# Altium schematic sheet Motor PSU Webench.schdoc
size 317 x 144 mm; SheetNumber: 1; SheetTotal: 1
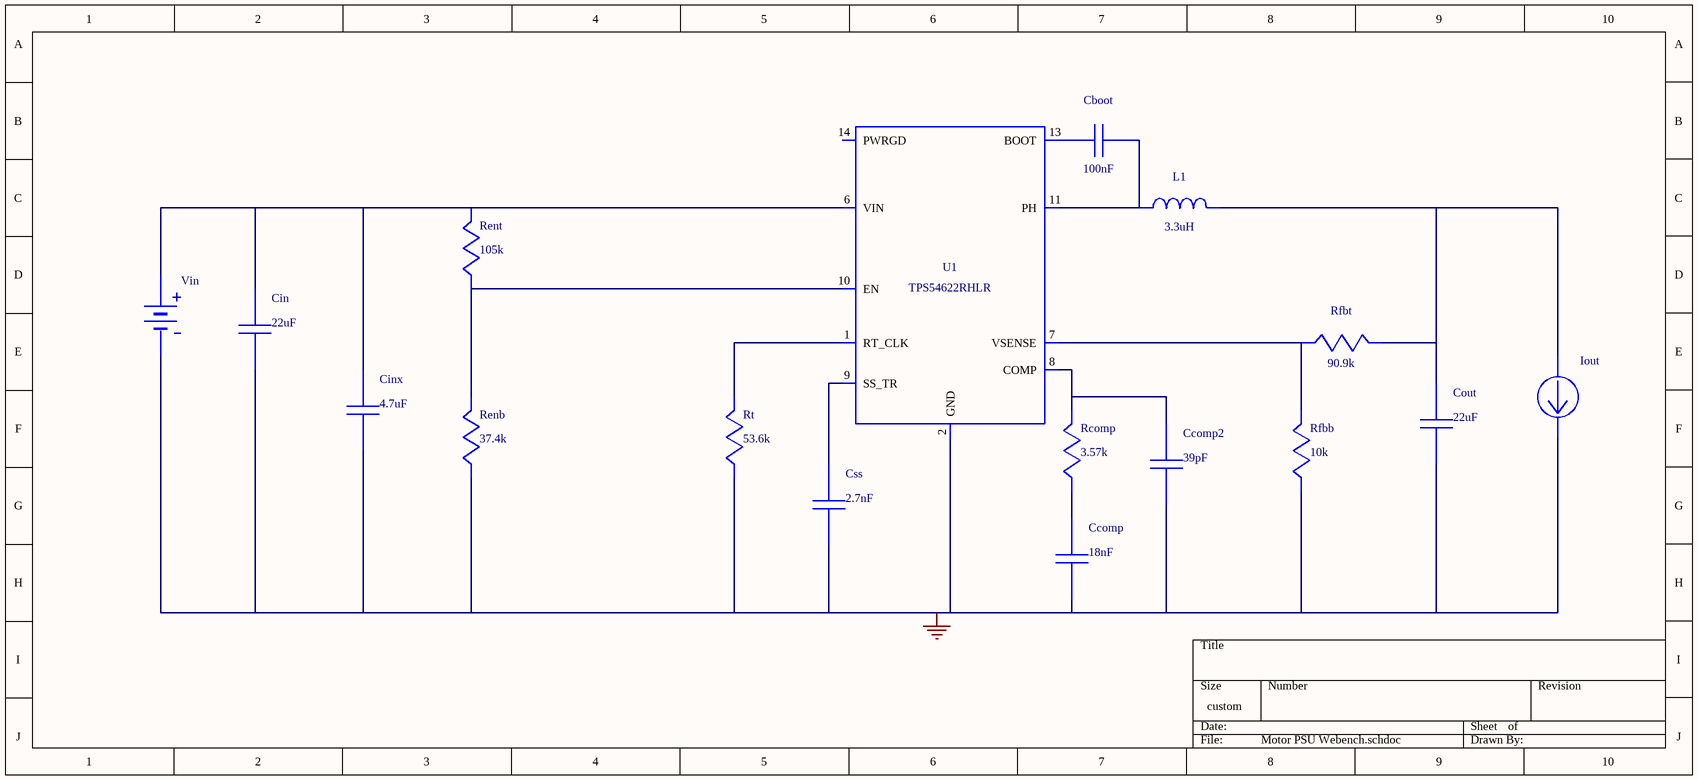
[diagram p0: Motor PSU Webench.schdoc]

## Parts
Cboot  value 100nF  (hidden comment: 08053C104KAT2A)
Ccomp  value 18nF  (hidden comment: CC0805KRX7R9BB183)
Ccomp2  value 39pF  (hidden comment: CC0805JRNPO9BN390)
Cin  value 22uF  (hidden comment: GRM31CR61C226ME15L)
Cinx  value 4.7uF  (hidden comment: GRM21BR61E475KA12L)
Cout  value 22uF  (hidden comment: GRM31CR61A226KE19L)
Css  value 2.7nF  (hidden comment: CC0805KRX7R9BB272)
Iout  WB_CURRENT_LOAD  (value not drawn)
L1  value 3.3uH  (hidden comment: SRP6540-3R3M)
Rcomp  value 3.57k  (hidden comment: CRCW04023K57FKED)
Renb  value 37.4k  (hidden comment: CRCW040237K4FKED)
Rent  value 105k  (hidden comment: CRCW0402105KFKED)
Rfbb  value 10k  (hidden comment: CRCW040210K0FKED)
Rfbt  value 90.9k  (hidden comment: CRCW040290K9FKED)
Rt  value 53.6k  (hidden comment: CRCW040253K6FKED)
U1  TPS54622RHLR
Vin  WB_BATTERY  (value not drawn)

## Nets
0: Ccomp.2 Ccomp2.2 Cin.2 Cinx.2 Cout.2 Css.2 Iout.2(-) Renb.2 Rfbb.2 Rt.2 U1.2(GND) U1.3(GND) U1.15(ETPAD) Vin.2(-)
NetCboot_1: Cboot.1 U1.13(BOOT)
NetCboot_2: Cboot.2 L1.1 U1.11(PH) U1.12(PH)
NetCcomp2_1: Ccomp2.1 Rcomp.1 U1.8(COMP)
NetCcomp_1: Ccomp.1 Rcomp.2
NetCin_1: Cin.1 Cinx.1 Rent.1 U1.4(PVIN) U1.5(PVIN) U1.6(VIN) Vin.1(+)
NetCout_1: Cout.1 Iout.1(+) L1.2 Rfbt.1
NetCss_1: Css.1 U1.9(SS_TR)
NetRenb_1: Renb.1 Rent.2 U1.10(EN)
NetRfbb_1: Rfbb.1 Rfbt.2 U1.7(VSENSE)
NetRt_1: Rt.1 U1.1(RT_CLK)

Not connected (* = marked no-connect by the designer): U1 14(PWRGD)

## Library data of the parts
Cboot = 08053C104KAT2A: Manufacturer Name: AVX; PackageReference: 08053C104KAT2A; Manufacturer Part Number: 08053C104KAT2A
Ccomp = CC0805KRX7R9BB183: CC0805KRX7R9BB18; Manufacturer Name: Yageo America; PackageReference: CC0805KRX7R9BB183; Manufacturer Part Number: CC0805KRX7R9BB183
Ccomp2 = CC0805JRNPO9BN390: CC0805JRNPO9BN39; Manufacturer Name: Yageo America; PackageReference: CC0805JRNPO9BN390; Manufacturer Part Number: CC0805JRNPO9BN390
Cin = GRM31CR61C226ME15L: GRM31CR61C226ME1; Manufacturer Name: MuRata; PackageReference: GRM31CR61C226ME15L; Manufacturer Part Number: GRM31CR61C226ME15L
Cinx = GRM21BR61E475KA12L: GRM21BR61E475KA1; Manufacturer Name: MuRata; PackageReference: GRM21BR61E475KA12L; Manufacturer Part Number: GRM21BR61E475KA12L
Cout = GRM31CR61A226KE19L: GRM31CR61A226KE1; Manufacturer Name: MuRata; PackageReference: GRM31CR61A226KE19L; Manufacturer Part Number: GRM31CR61A226KE19L
Css = CC0805KRX7R9BB272: CC0805KRX7R9BB27; Manufacturer Name: Yageo America; PackageReference: CC0805KRX7R9BB272; Manufacturer Part Number: CC0805KRX7R9BB272
Iout = WB_CURRENT_LOAD: Value: UNLISTED; PackageReference: WB_CURRENT_LOAD; Manufacturer Part Number: WB_CURRENT_LOAD; Manufacturer Name: WB_CURRENT_LOAD
L1 = SRP6540-3R3M: Unknown; Manufacturer Name: Bourns; PackageReference: SRP6540-3R3M; Manufacturer Part Number: SRP6540-3R3M
Rcomp = CRCW04023K57FKED: Manufacturer Name: Vishay-Dale; PackageReference: CRCW04023K57FKED; Manufacturer Part Number: CRCW04023K57FKED
Renb = CRCW040237K4FKED: Manufacturer Name: Vishay-Dale; PackageReference: CRCW040237K4FKED; Manufacturer Part Number: CRCW040237K4FKED
Rent = CRCW0402105KFKED: Manufacturer Name: Vishay-Dale; PackageReference: CRCW0402105KFKED; Manufacturer Part Number: CRCW0402105KFKED
Rfbb = CRCW040210K0FKED: Manufacturer Name: Vishay-Dale; PackageReference: CRCW040210K0FKED; Manufacturer Part Number: CRCW040210K0FKED
Rfbt = CRCW040290K9FKED: Manufacturer Name: Vishay-Dale; PackageReference: CRCW040290K9FKED; Manufacturer Part Number: CRCW040290K9FKED
Rt = CRCW040253K6FKED: Manufacturer Name: Vishay-Dale; PackageReference: CRCW040253K6FKED; Manufacturer Part Number: CRCW040253K6FKED
U1 = TPS54622RHLR: Manufacturer Name: Texas Instruments; Value: UNLISTED; PackageReference: TPS54622RHLR; Manufacturer Part Number: TPS54622RHLR
Vin = WB_BATTERY: Value: UNLISTED; PackageReference: WB_BATTERY; Manufacturer Part Number: WB_BATTERY; Manufacturer Name: WB_BATTERY